# EAGLE design sce (EAGLE 7.6.0)
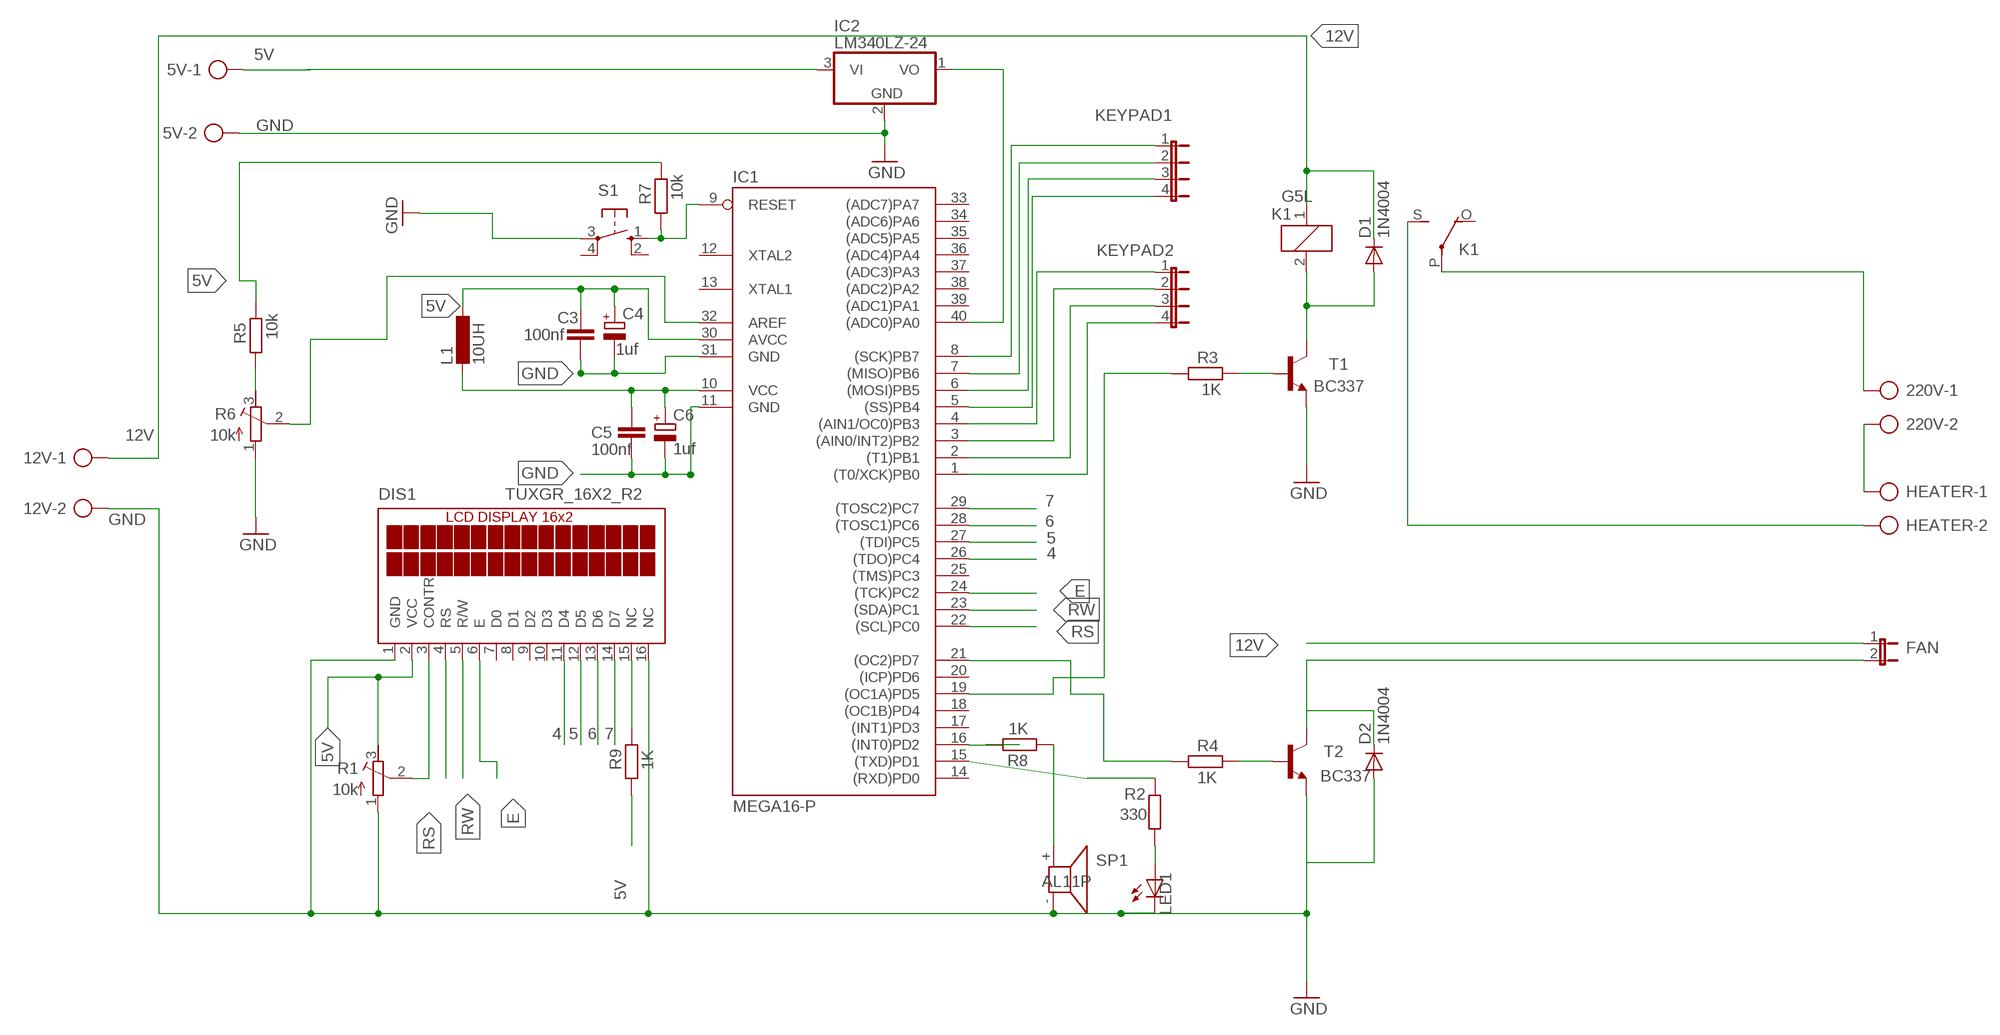
[diagram p0: schematic, sheet 1]

## Parts
5V  AK500/2  [AK500/2]
12V  AK500/2  [AK500/2]
220V  AK500/2  [AK500/2]
C3  100nf  C-EU025-025X050  [C025-025X050]
C4  1uf  CPOL-EUE2.5-5  [E2,5-5]
C5  100nf  C-EU025-025X050  [C025-025X050]
C6  1uf  CPOL-EUE2.5-5  [E2,5-5]
D1  1N4004  [DO41-10]
D2  1N4004  [DO41-10]
DIS1  TUXGR_16X2_R2  [TUXGR_16X2_R2]
FAN  JP1E  [JP1]
HEATER  AK500/2  [AK500/2]
IC1  MEGA16-P  [DIL40]
IC2  LM340LZ-24  [TO92]
K1  G5L  [G5LE]
KEYPAD1  JP4E  [JP4]
KEYPAD2  JP4E  [JP4]
L1  10UH  L-EU6000-XXX-RC  [6000-XXXX-RC]
LED1  LED5MM  [LED5MM]
R1  10k  R-TRIMM3339P  [RTRIM3339P]
R2  330  R-EU_0207/10  [0207/10]
R3  1K  R-EU_0207/10  [0207/10]
R4  1K  R-EU_0207/10  [0207/10]
R5  10k  R-EU_0207/10  [0207/10]
R6  10k  R-TRIMM3339P  [RTRIM3339P]
R7  10k  R-EU_0207/10  [0207/10]
R8  1K  R-EU_0207/10  [0207/10]
R9  1K  R-EU_0207/10  [0207/10]
S1  10-XX  [B3F-10XX]
SP1  AL11P  [AL11P]
T1  BC337  [TO92]
T2  BC337  [TO92]

## Nets
1: C5.1 C6.+ IC1.10(VCC) L1.2
4: DIS1.11(D4) IC1.26((TDO)PC4)
5: DIS1.12(D5) IC1.27((TDI)PC5)
5V: 5V.1 C3.1 C4.+ DIS1.2(VCC) IC1.30(AVCC) IC2.3(VI) L1.1 R1.3(E) R5.2 R7.2 R9.1
6: DIS1.13(D6) IC1.28((TOSC1)PC6)
7: DIS1.14(D7) IC1.29((TOSC2)PC7)
12V: 12V.1 D1.C FAN.1 K1.1
E: DIS1.6(E) IC1.24((TCK)PC2)
GND: 5V.2 12V.2 C3.2 C4.- C5.2 C6.- D2.A DIS1.1(GND) DIS1.16(NC) IC1.11(GND) IC1.31(GND) IC2.2(GND) LED1.K(C) R1.1(A) R6.1(A) SP1.- T1.1(E) T2.1(E)
HOT: IC1.40((ADC0)PA0) IC2.1(VO)
KEYPAD2: IC1.1((T0/XCK)PB0) KEYPAD2.4
N$1: S1.3(P) ; supply symbol labelled GND
N$2: IC1.9(RESET) R7.1 S1.1(S)
N$3: R4.2 T2.2(B)
N$4: R3.2 T1.2(B)
N$5: IC1.21((OC2)PD7) R4.1
N$6: IC1.3((AIN0/INT2)PB2) KEYPAD2.2
N$7: IC1.19((OC1A)PD5) R3.1
N$8: D1.A K1.2 T1.3(C)
N$9: IC1.5((SS)PB4) KEYPAD1.4
N$10: 220V.1 K1.P(2:P)
N$11: 220V.2 HEATER.1
N$12: IC1.16((INT0)PD2) R8.2
N$13: IC1.2((T1)PB1) KEYPAD2.3
N$14: HEATER.2 K1.S(2:S)
N$15: IC1.4((AIN1/OC0)PB3) KEYPAD2.1
N$16: D2.C FAN.2 T2.3(C)
N$17: IC1.15((TXD)PD1) R2.2
N$18: DIS1.3(CONTR) R1.2(S)
N$19: IC1.6((MOSI)PB5) KEYPAD1.3
N$20: LED1.A R2.1
N$21: IC1.7((MISO)PB6) KEYPAD1.2
N$22: R8.1 SP1.+
N$23: IC1.8((SCK)PB7) KEYPAD1.1
N$24: IC1.32(AREF) R6.2(S)
N$25: R5.1 R6.3(E)
N$26: DIS1.15(NC) R9.2
RS: DIS1.4(RS) IC1.22((SCL)PC0)
RW: DIS1.5(R/W) IC1.23((SDA)PC1)
Unconnected: DIS1.7(D0) DIS1.8(D1) DIS1.9(D2) DIS1.10(D3) IC1.12(XTAL2) IC1.13(XTAL1) IC1.14((RXD)PD0) IC1.17((INT1)PD3) IC1.18((OC1B)PD4) IC1.20((ICP)PD6) IC1.25((TMS)PC3) IC1.33((ADC7)PA7) IC1.34((ADC6)PA6) IC1.35((ADC5)PA5) IC1.36((ADC4)PA4) IC1.37((ADC3)PA3) IC1.38((ADC2)PA2) IC1.39((ADC1)PA1) K1.O(2:O) S1.2(S1) S1.4(P1)

## Library data of the parts
5V 12V 220V HEATER = con-ptr500:AK500/2: CONNECTOR; OC_FARNELL: unknown; OC_NEWARK: unknown
C3 C5 = rcl:C-EU: CAPACITOR, European symbol
C4 C6 = rcl:CPOL-EU: POLARIZED CAPACITOR, European symbol
D1 D2 = diode:1N4004: DIODE general purpose rectifier, 1 A
DIS1 = display-lcd:TUXGR_16X2_R2: Tuxgraphics LCD display 16x2 characters reflective, without background light Source: tuxgr_12x2_r2.pdf; OC_FARNELL: unknown; OC_NEWARK: unknown
FAN = jumper:JP1E: JUMPER
IC1 = atmel:MEGA16-P: MICROCONTROLLER 16 Kbytes FLASH 1 kbytes SRAM 512 bytes EEPROM USART 8-channel 10 bit ADC Source: avr.lbr; MPN: ATMEGA16-16PU; OC_FARNELL: 9171142; OC_NEWARK: 01M6885
IC2 = linear:LM340?-*: Positive VOLTAGE REGULATOR Source: http://cache.national.com/ds/LM/LM340.pdf
K1 = relay:G5L: RELAY 1 x switch, 10 A/120 V AC, 8 A/30 V ADC, Omron; OC_FARNELL: unknown; OC_NEWARK: unknown
KEYPAD1 KEYPAD2 = jumper:JP4E: JUMPER
L1 = rcl:L-EU: INDUCTOR, European symbol
LED1 = led:LED: LED OSRAM: - CHIPLED LG R971, LG N971, LY N971, LG Q971, LY Q971, LO R971, LY R971 LH N974, LH R974 LS Q976, LO Q976, LY Q976 LO Q996 - Hyper CHIPLED LW Q18S LB Q993, LB Q99A, LB R99A - SideLED LS A670, LO A670, LY A670, LG A670, LP A670 LB A673, LV A673, LT A673, LW A673 LH A674 LY A675 LS A676, LA A676, LO A676, LY A676, LW A676 LS A679, LY A679, LG A679 - Hyper Micro SIDELED® LS Y876, LA Y876, LO Y876, LY Y876 LT Y87S - SmartLED LW L88C, LW L88S LB L89C, LB L89S, LG L890 LS L89K, LO L89K, LY L89K LS L896, LA L896, LO L896, LY L896 - TOPLED LS T670, LO T670, LY T670, LG T670, LP T670 LSG T670, LSP T670, LSY T670, LOP T670, LYG T670 LG T671, LOG T671, LSG T671 LB T673, LV T673, LT T673, LW T673 LH T674 LS T676, LA T676, LO T676, LY T676, LB T676, LH T676, LSB T676, LW T676 LB T67C, LV T67C, LT T67C, LS T67K, LO T67K, LY T67K, LW E67C LS E67B, LA E67B, LO E67B, LY E67B, LB E67C, LV E67C, LT E67C LW T67C LS T679, LY T679, LG T679 LS T770, LO T770, LY T770, LG T770, LP T770 LB T773, LV T773, LT T773, LW T773 LH T774 LS E675, LA E675, LY E675, LS T675 LS T776, LA T776, LO T776, LY T776, LB T776 LHGB T686 LT T68C, LB T68C - Hyper Mini TOPLED® LB M676 - Mini TOPLED Santana® LG M470 LS M47K, LO M47K, LY M47K Source: http://www.osram.convergy.de LUXEON: - LUMILED® LXK2-PW12-R00, LXK2-PW12-S00, LXK2-PW14-U00, LXK2-PW14-V00 LXK2-PM12-R00, LXK2-PM12-S00, LXK2-PM14-U00 LXK2-PE12-Q00, LXK2-PE12-R00, LXK2-PE12-S00, LXK2-PE14-T00, LXK2-PE14-U00 LXK2-PB12-K00, LXK2-PB12-L00, LXK2-PB12-M00, LXK2-PB14-N00, LXK2-PB14-P00, LXK2-PB14-Q00 LXK2-PR12-L00, LXK2-PR12-M00, LXK2-PR14-Q00, LXK2-PR14-R00 LXK2-PD12-Q00, LXK2-PD12-R00, LXK2-PD12-S00 LXK2-PH12-R00, LXK2-PH12-S00 LXK2-PL12-P00, LXK2-PL12-Q00, LXK2-PL12-R00 Source: www.luxeon.com KINGBRIGHT: KA-3528ASYC Source: www.kingbright.com
R1 R6 = rcl:R-TRIMM: Trimm resistor
R2-R5 R7-R9 = rcl:R-EU_: RESISTOR, European symbol
S1 = switch-omron:10-XX: OMRON SWITCH; MPN: B3F-1000; OC_FARNELL: 176432; OC_NEWARK: 36M3542
SP1 = buzzer:AL11P: SPEAKER Source: Buerklin; OC_FARNELL: unknown; OC_NEWARK: unknown
T1 T2 = transistor:BC337: NPN TRANSISTOR

## Board
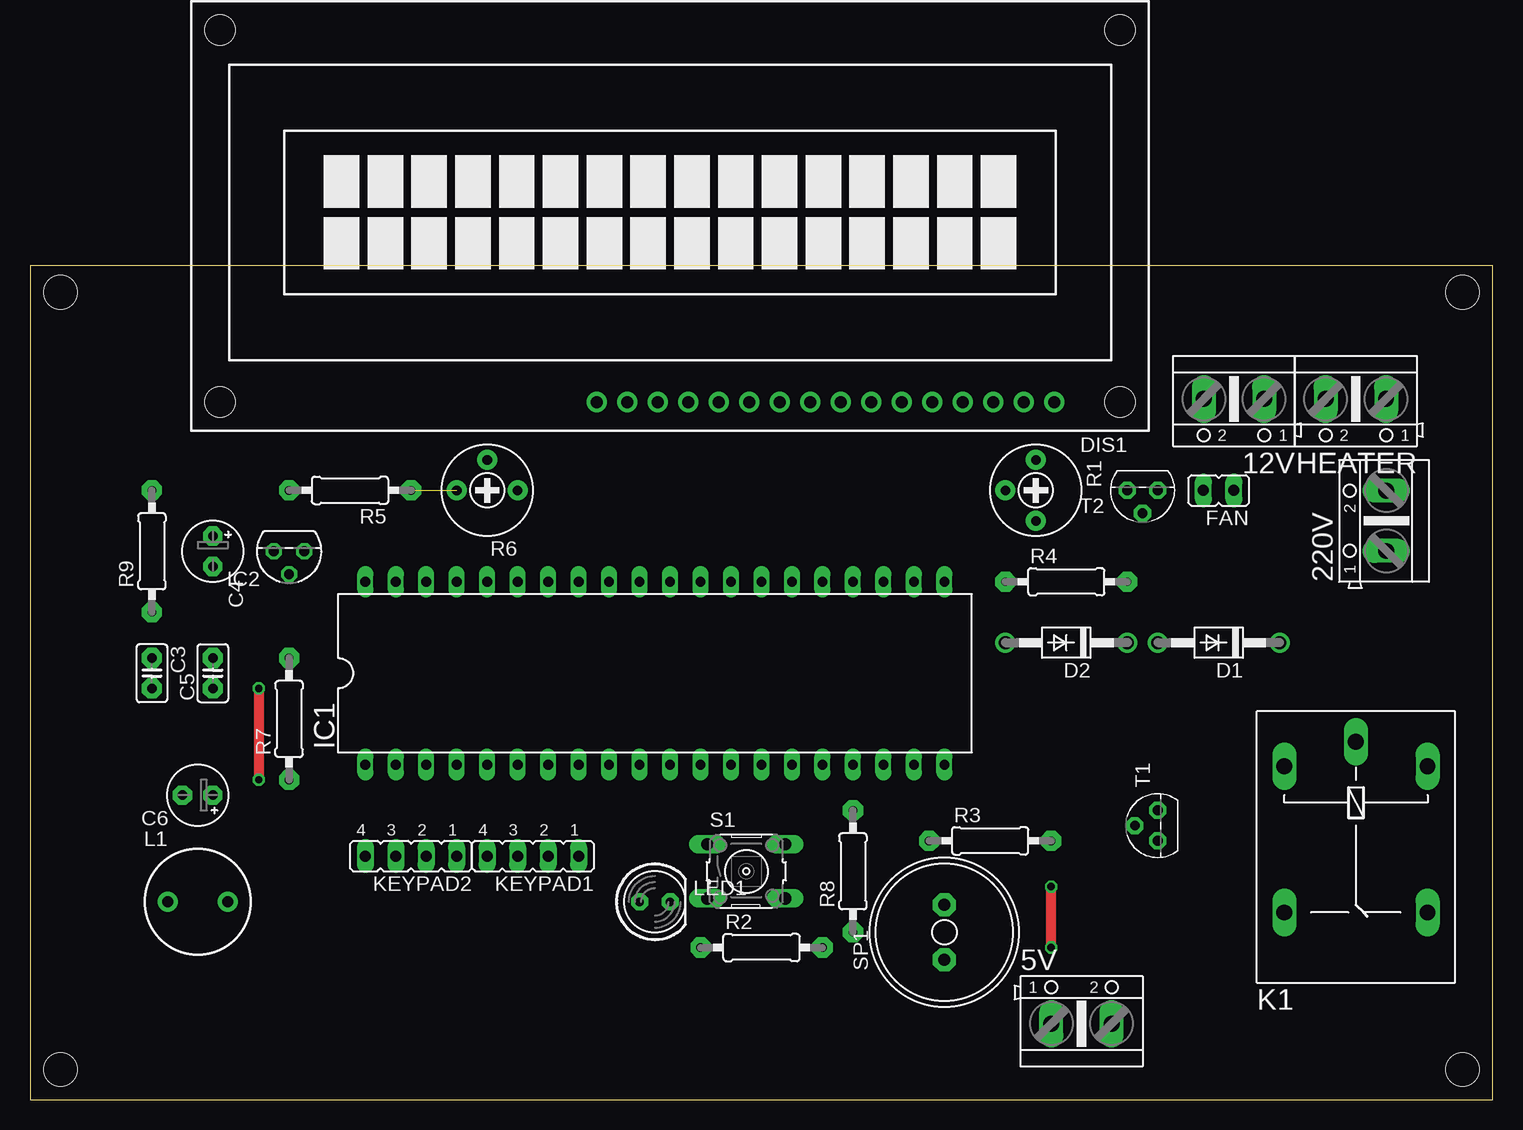
[diagram p1: board, top side]
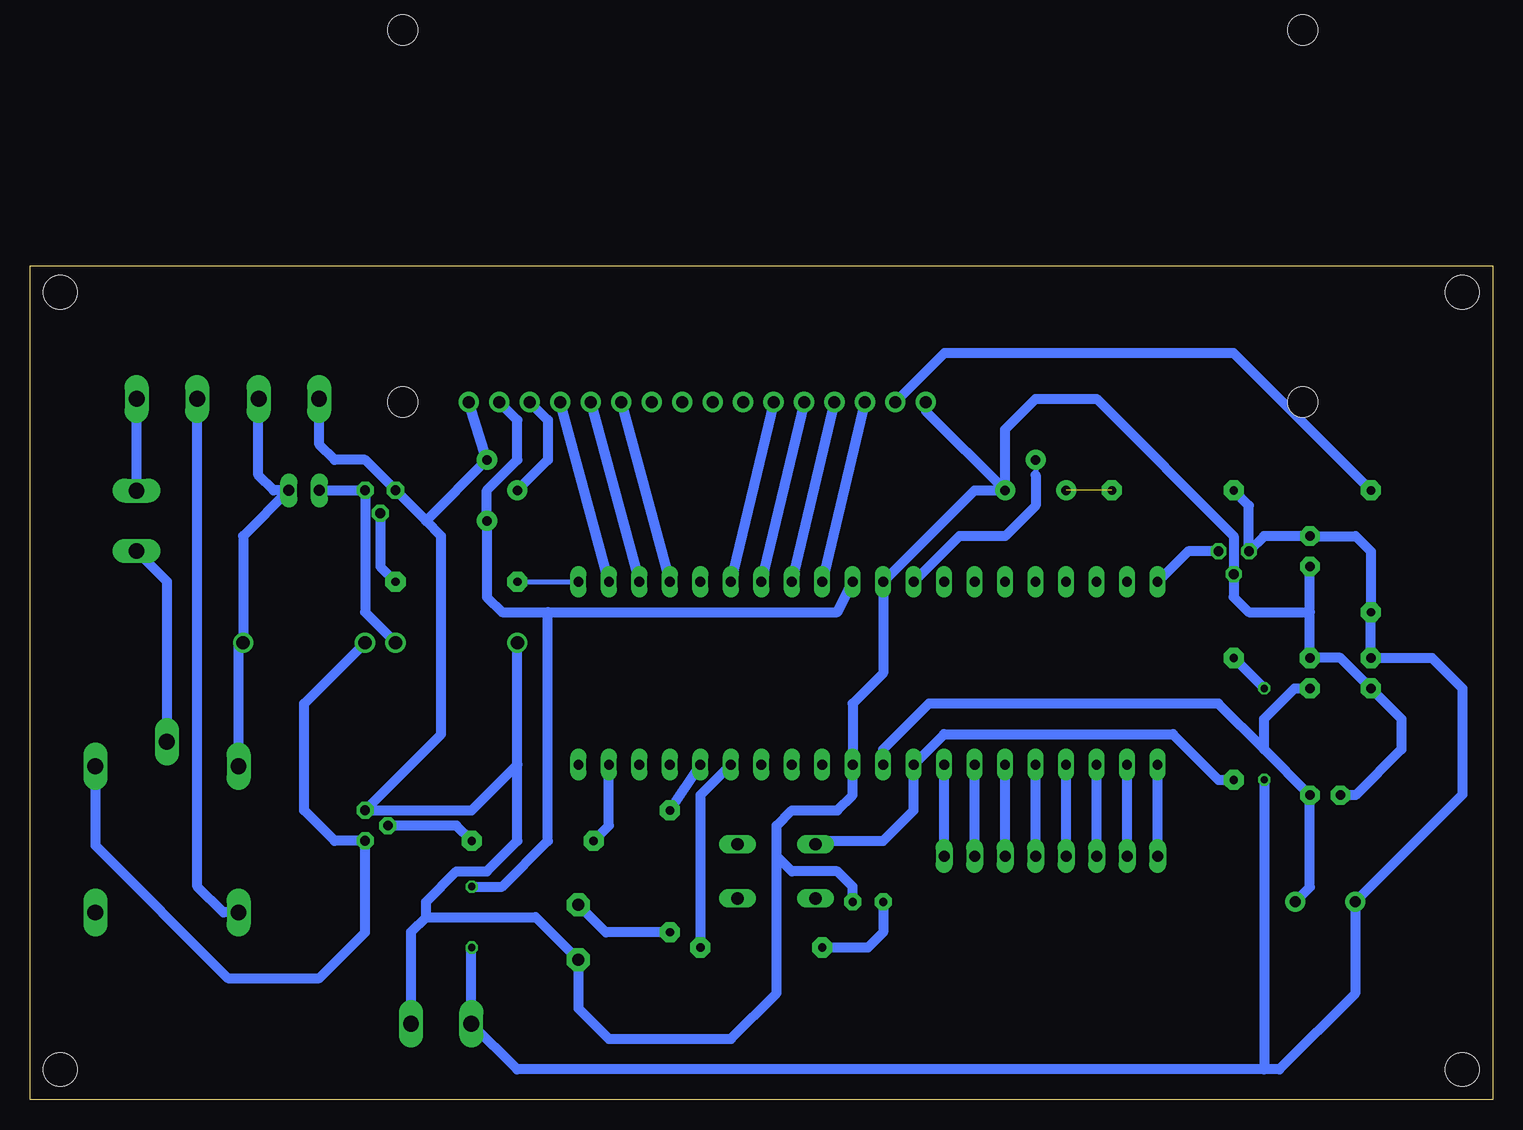
[diagram p2: board, bottom side, seen from below]

Size 121.9 x 69.52 mm. Coordinates in mm from the lower left corner, seen from the top.
Outline: 0,0 121.9,0 121.9,69.52 0,69.52 0,0
Copper layers (1*16): Top 0.035mm / dielectric 1.5mm / Bottom 0.035mm
Design rules "default": minimum track width 10mil, minimum drill 24mil, track to track 8mil, track to pad 8mil, pad to pad 8mil, via to via 8mil, smd to smd 8mil, copper to edge 40mil, drill to drill 8mil, minimum pad ring 10mil, minimum via ring 8mil, stop-mask expansion 4mil, vias tented up to drill 0mil, thermal gap 10mil
Holes 2.8 mm at 2.54,67.31 119.38,67.31 119.38,2.54 2.54,2.54

### Footprints (pad centres in the part's own frame; a part is rotated, then mirrored left to right if it is on the bottom)
AK500/2 = drill 1.321 long: 1 -2.515,0; 2 2.515,0
C025-025X050 = drill 0.813 pad 1.676 octagon: 1 -1.27,0; 2 1.27,0
E2,5-5 = drill 0.813 pad 1.6 octagon: + -1.27,0; - 1.27,0
DO41-10 = drill 1.118: A 5.08,0; C -5.08,0
TUXGR_16X2_R2 = drill 1 pad 1.676: 1 -32,15.5; 2 -29.46,15.5; 3 -26.92,15.5; 4 -24.38,15.5; 5 -21.84,15.5; 6 -19.3,15.5; 7 -16.76,15.5; 8 -14.22,15.5; 9 -11.68,15.5; 10 -9.14,15.5; 11 -6.6,15.5; 12 -4.06,15.5; 13 -1.52,15.5; 14 1.02,15.5; 15 3.56,15.5; 16 6.1,15.5 | hole 2.5: -37.5,-15.5; 37.5,-15.5; -37.5,15.5; 37.5,15.5
JP1 = drill 0.914 long: 1 0,-1.27; 2 0,1.27
DIL40 = drill 0.813 long: 1 -24.13,-7.62; 2 -21.59,-7.62; 3 -19.05,-7.62; 4 -16.51,-7.62; 5 -13.97,-7.62; 6 -11.43,-7.62; 7 -8.89,-7.62; 8 -6.35,-7.62; 9 -3.81,-7.62; 10 -1.27,-7.62; 11 1.27,-7.62; 12 3.81,-7.62; 13 6.35,-7.62; 14 8.89,-7.62; 15 11.43,-7.62; 16 13.97,-7.62; 17 16.51,-7.62; 18 19.05,-7.62; 19 21.59,-7.62; 20 24.13,-7.62; 21 24.13,7.62; 22 21.59,7.62; 23 19.05,7.62; 24 16.51,7.62; 25 13.97,7.62; 26 11.43,7.62; 27 8.89,7.62; 28 6.35,7.62; 29 3.81,7.62; 30 1.27,7.62; 31 -1.27,7.62; 32 -3.81,7.62; 33 -6.35,7.62; 34 -8.89,7.62; 35 -11.43,7.62; 36 -13.97,7.62; 37 -16.51,7.62; 38 -19.05,7.62; 39 -21.59,7.62; 40 -24.13,7.62
TO92 = drill 0.813 octagon: 1 -1.27,0; 2 0,1.905; 3 1.27,0
G5LE = drill 1.321 long: 1 -7.493,-5.969; 2 -7.493,5.969; O 4.699,5.969; P -9.525,0; S 4.699,-5.969
JP4 = drill 0.914 long: 1 -3.81,0; 2 -1.27,0; 3 1.27,0; 4 3.81,0
6000-XXXX-RC = drill 0.9 pad 1.676: 1 -2.5,0; 2 2.5,0
LED5MM = drill 0.7 pad 1.422 octagon: A -1.27,0; K 1.27,0
RTRIM3339P = drill 0.8 pad 1.676: 1 -2.54,0; 2 0,-2.54; 3 2.54,0
0207/10 = drill 0.7 pad 1.676 octagon: 1 -5.08,0; 2 5.08,0
B3F-10XX = drill 1.016 long: 1 -3.251,2.261; 2 3.251,2.261; 3 -3.251,-2.261; 4 3.251,-2.261
AL11P = drill 1.016 pad 1.93 octagon: + 2.286,0; - -2.286,0
TO92' = drill 0.813 pad 1.422 octagon: 1 1.27,0; 2 0,1.905; 3 -1.27,0

### Placement (x,y rotation side)
5V  87.63,6.35 0 top
12V  100.33,58.42 180 top
220V  113.03,48.26 90 top
C3  10.16,35.56 270 top
C4  15.24,45.72 270 top
C5  15.24,35.56 90 top
C6  13.97,25.4 180 top
D1  99.06,38.1 180 top
D2  86.36,38.1 180 top
DIS1  53.34,73.66 180 top
FAN  99.06,50.8 90 top
HEATER  110.49,58.42 180 top
IC1  52.07,35.56 0 top
IC2  21.59,45.72 180 top
K1  110.49,20.32 270 top
KEYPAD1  41.91,20.32 180 top
KEYPAD2  31.75,20.32 180 top
L1  13.97,16.51 0 top
LED1  52.07,16.51 0 top
R1  83.82,50.8 270 top
R2  60.96,12.7 0 top
R3  80.01,21.59 0 top
R4  86.36,43.18 0 top
R5  26.67,50.8 180 top
R6  38.1,50.8 180 top
R7  21.59,31.75 90 top
R8  68.58,19.05 90 top
R9  10.16,45.72 90 top
S1  59.69,19.05 0 top
SP1  76.2,13.97 90 top
T1  BC337  [TO92']  93.98,22.86 90 top
T2  BC337  [TO92']  92.71,50.8 180 top

### Tracks (layer width: path | path; a pad name or v marks a point on that pad's centre or on a via)
1
  Bottom 0.813: L1.2 15.24,17.74 C6.+ 19.05,29.21 | 19.05,29.21 19.05,31.75 16.51,34.29 C5.1 | 19.05,29.21 22.86,33.02 46.99,33.02 50.8,29.21 IC1.10
4
  Bottom 0.813: DIS1.11 IC1.26
5
  Bottom 0.813: DIS1.12 IC1.27
5V  (via drill 0.6)
  Top 0.813: v85.09,12.7 v85.09,17.78 | v19.05,34.29 v19.05,26.67
  Bottom 0.406: v85.09,12.7 85.11,12.7
  Bottom 0.813: v85.09,12.7 85.11,12.68 5V.1 81.31,2.54 19.05,2.54 | 19.05,2.54 17.78,2.54 11.47,8.85 L1.1 2.54,25.44 2.54,34.29 5.08,36.83 C3.1 R9.1 10.16,45.72 11.43,46.99 C4.+ 19.05,46.99 IC2.3 20.32,49.53 R5.2 | DIS1.2 81.28,56.64 81.28,53.34 83.82,50.8 R1.3 83.82,41.91 82.55,40.64 78.74,40.64 | 78.74,40.64 54.61,40.64 IC1.30 | v85.09,17.78 82.55,17.78 78.74,21.59 78.74,40.64 | R7.2 v19.05,34.29 | v19.05,26.67 19.05,2.54
6
  Bottom 0.813: DIS1.13 IC1.28
7
  Bottom 0.813: DIS1.14 IC1.29
12V
  Bottom 0.813: 12V.1 102.87,58.42 102.87,52.07 101.6,50.8 FAN.1 104.14,46.99 D1.C 104.52,37.72 K1.1
E
  Bottom 0.813: DIS1.6 IC1.24
GND
  Bottom 0.406: IC2.2 21.59,43.18 | DIS1.1 85.09,57.91 | D2.A 81.28,36.83
  Bottom 0.813: 81.28,27.94 85.09,24.13 T1.1 87.63,30.48 87.63,46.99 88.9,48.26 | 81.28,27.94 D2.A | 88.9,48.26 T2.1 93.98,53.34 96.52,53.34 97.79,54.61 97.79,58.42 12V.2 | DIS1.1 R1.1 88.9,48.26 | 5V.2 90.14,14 88.9,15.24 | 88.9,15.24 79.76,15.24 SP1.- 76.2,7.62 73.66,5.08 63.5,5.08 59.69,8.89 59.69,20.32 | LED1.K 53.34,17.78 54.61,19.05 58.42,19.05 59.69,20.32 | 59.69,20.32 59.69,22.86 58.42,24.13 54.61,24.13 53.34,25.4 IC1.11 53.34,33.02 50.8,35.56 IC1.31 43.18,50.8 R6.1 | 88.9,15.24 88.9,16.51 86.36,19.05 83.82,19.05 81.28,21.59 81.28,27.94 | C6.- 11.43,25.4 7.62,29.21 7.62,31.75 C3.2 12.7,36.83 C5.2 15.24,40.64 | 15.24,40.64 C4.- | DIS1.16 47.24,57.4 R6.1 | R6.1 40.64,55.88 38.1,58.42 33.02,58.42 21.59,46.99 IC2.2 21.59,41.91 20.32,40.64 15.24,40.64
HOT
  Bottom 0.813: IC2.1 25.4,45.72 IC1.40
KEYPAD2
  Bottom 0.813: KEYPAD2.4 IC1.1
N$2
  Bottom 0.813: S1.1 56.16,21.59 50.8,21.59 48.26,24.13 IC1.9 45.72,30.48 26.67,30.48 22.86,26.67 R7.1
N$3
  Bottom 0.813: T2.2 92.71,44.45 R4.2
N$4
  Bottom 0.813: R3.2 86.36,22.86 T1.2
N$5
  Bottom 0.406: R4.1 IC1.21
N$6
  Bottom 0.813: KEYPAD2.2 IC1.3
N$7
  Bottom 0.813: R3.1 73.66,22.86 IC1.19
N$8
  Bottom 0.813: K1.2 116.46,21.21 105.41,10.16 97.79,10.16 93.98,13.97 T1.3 96.52,21.59 99.06,24.13 99.06,33.02 D1.A
N$9
  Bottom 0.813: KEYPAD1.4 IC1.5
N$10
  Bottom 0.813: 220V.1 110.49,43.2 K1.P
N$11
  Bottom 0.406: 113,50.8 arc90 220V.2
  Bottom 0.813: 113,50.8 HEATER.1
N$12
  Bottom 0.813: IC1.16 R8.2
N$13
  Bottom 0.813: KEYPAD2.3 IC1.2
N$14
  Bottom 0.813: K1.S 105.79,15.62 107.95,17.78 107.95,58.39 HEATER.2
N$15
  Bottom 0.813: KEYPAD2.1 IC1.4
N$16
  Bottom 0.813: FAN.2 T2.3 93.98,40.64 D2.C
N$17
  Bottom 0.813: IC1.15 66.04,25.4 R2.2
N$18
  Bottom 0.813: DIS1.3 78.74,56.64 78.74,53.34 R1.2
N$19
  Bottom 0.813: KEYPAD1.3 IC1.6
N$20
  Bottom 0.406: 54.61,12.7 R2.1
  Bottom 0.813: LED1.A 50.8,13.97 52.07,12.7 R2.1
N$21
  Bottom 0.813: KEYPAD1.2 IC1.7
N$22
  Bottom 0.813: R8.1 73.91,13.97 SP1.+
N$23
  Bottom 0.813: KEYPAD1.1 IC1.8
N$24
  Bottom 0.406: R6.2 38.1,52.07
  Bottom 0.813: 38.1,52.07 38.1,49.53 40.64,46.99 44.45,46.99 IC1.32
N$25  (1 unrouted)
N$26
  Bottom 0.813: R9.2 21.59,62.23 45.71,62.23 DIS1.15
RS
  Bottom 0.813: IC1.22 DIS1.4
RW
  Bottom 0.813: DIS1.5 IC1.23